# Altium schematic sheet PCB.SchDoc
size A4
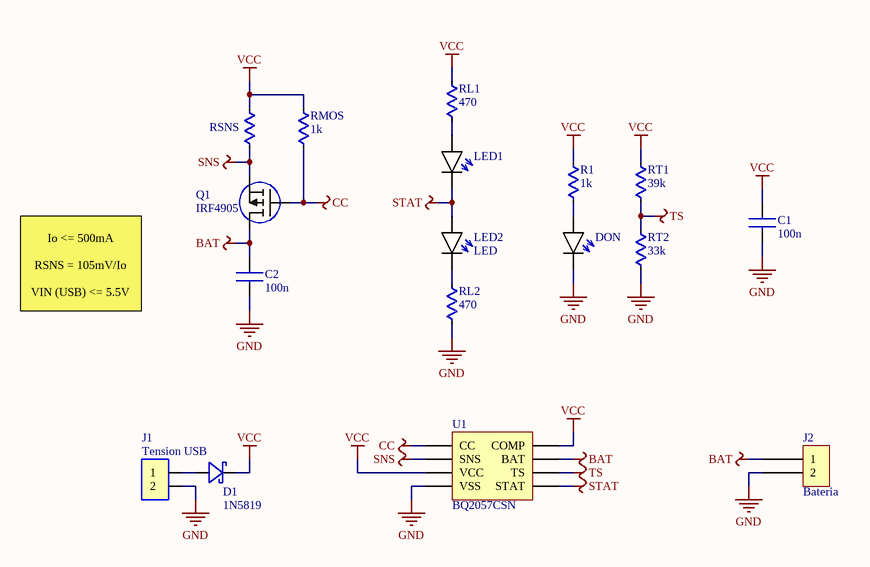
[diagram p0: PCB.SchDoc]

## Parts
C1  value 100n  [CAP-CER]  (hidden comment: CAP-CER)
C2  value 100n  [CAP-CER]  (hidden comment: CAP-CER)
D1  1N5819  [DO-41]
DON  LED  [LED-3MM-RED]  (value not drawn)
J1  Tension USB  [BLOCK_TERMINAL-2]
J2  Bateria  [HEADER 1x2]
LED1  LED  [LED-3MM-GREEN]  (value not drawn)
LED2  LED  [LED-3MM-RED]
Q1  IRF4905  [TO-220]
R1  value 1k  [RES VERTICAL]  (hidden comment: RES)
RL1  value 470  [AXIAL-0.3]  (hidden comment: RES)
RL2  value 470  [RES VERTICAL]  (hidden comment: RES)
RMOS  value 1k  [RES VERTICAL]  (hidden comment: RES)
RSNS  RES  [RES VERTICAL]  (value not drawn)
RT1  value 39k  [RES VERTICAL]  (hidden comment: RES)
RT2  value 33k  [RES VERTICAL]  (hidden comment: RES)
U1  BQ2057CSN  [SOIC-8]

## Nets
BAT: C2.2 J2.1 Q1.D U1.2(BAT)
CC: Q1.G RMOS.1 U1.7(CC)
GND: C1.1 C2.1 DON.K J1.2 J2.2 RL2.2 RT2.1 U1.6(VSS)
SNS: Q1.S RSNS.2 U1.1(SNS)
STAT: LED1.K LED2.A U1.5(STAT)
TS: RT1.1 RT2.2 U1.4(TS)
VCC: C1.2 D1.K R1.2 RL1.1 RMOS.2 RSNS.1 RT1.2 U1.3(VCC) U1.8(COMP)
NetD1_A: D1.A J1.1
NetDON_A: DON.A R1.1
NetLED1_A: LED1.A RL1.2
NetLED2_K: LED2.K RL2.1

## Notes on the sheet
- Io <= 500mA
  RSNS = 105mV/Io
  VIN (USB) <= 5.5V

## Library data of the parts
D1 = SCHOTTKY: NAME: 1N5819
J1 = 2-BLOCK_TERMINAL
J2 = Header 1x2
Q1 = P-MOSFET: pin to pad: D>2 G>1 S>3
U1 = BQ2057